# Altium schematic sheet Sheet1.SchDoc
size 420 x 297 mm; SheetNumber: 1; SheetTotal: 2
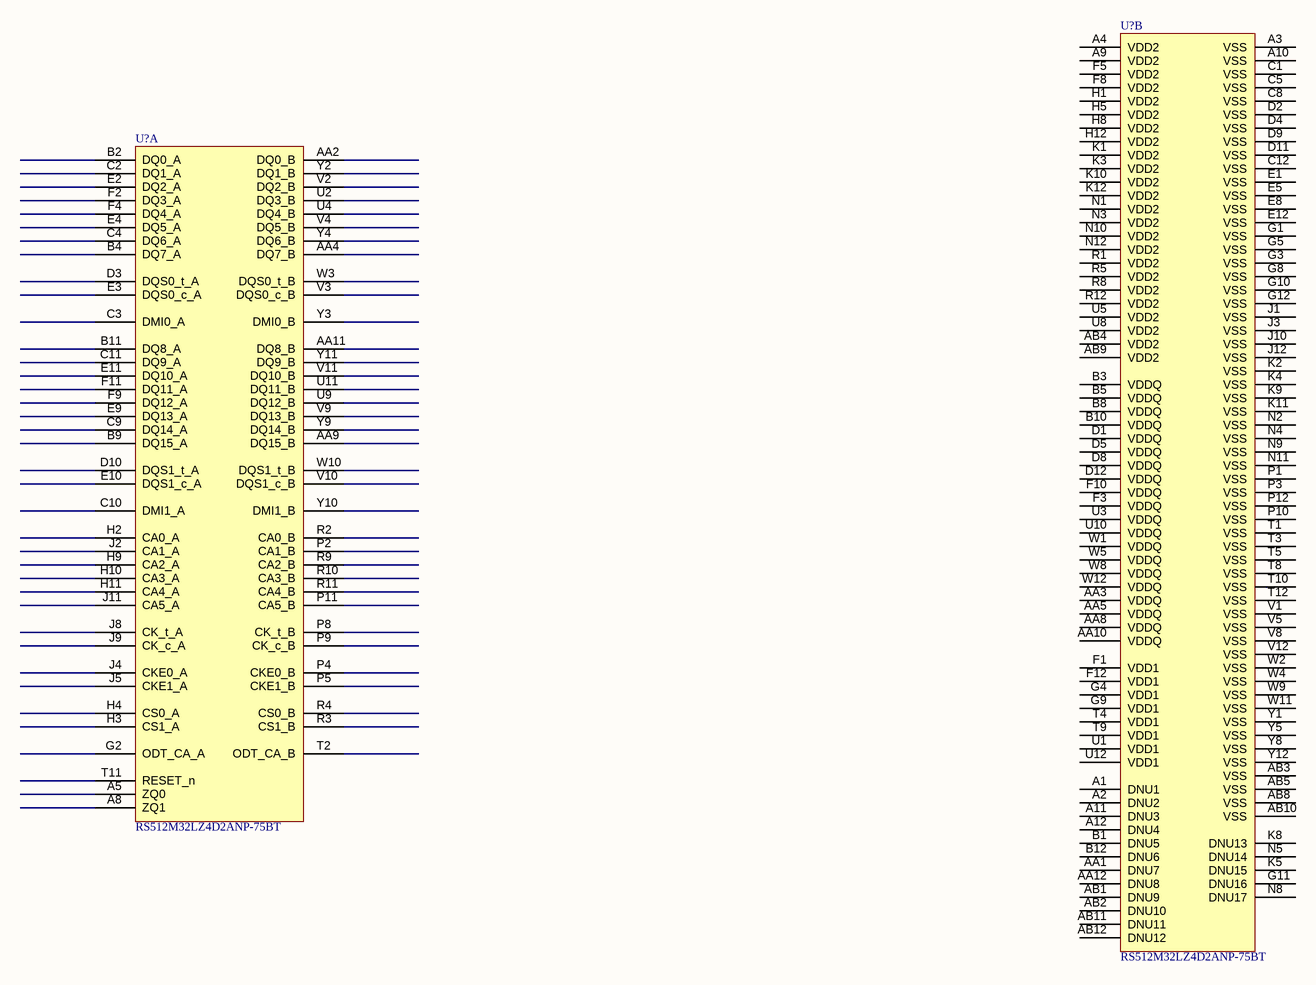
[diagram p0: Sheet1.SchDoc]

## Parts
(Parts that share a designator on the sheet are numbered #1, #2 ... from top to bottom, then left to right.)
U?#1  RS512M32LZ4D2ANP-75BT  [FBGA200_SMD]  (part B of 2)
U?#2  RS512M32LZ4D2ANP-75BT  [FBGA200_SMD]  (part A of 2)

## Nets

Not connected (* = marked no-connect by the designer): U?#1 A1(DNU1) A2(DNU2) A3(VSS) A4(VDD2) A9(VDD2) A10(VSS) A11(DNU3) A12(DNU4) AA1(DNU7) AA3(VDDQ) AA5(VDDQ) AA8(VDDQ) AA10(VDDQ) AA12(DNU8) AB1(DNU9) AB2(DNU10) AB3(VSS) AB4(VDD2) AB5(VSS) AB8(VSS) AB9(VDD2) AB10(VSS) AB11(DNU11) AB12(DNU12) B1(DNU5) B3(VDDQ) B5(VDDQ) B8(VDDQ) B10(VDDQ) B12(DNU6) C1(VSS) C5(VSS) C8(VSS) C12(VSS) D1(VDDQ) D2(VSS) D4(VSS) D5(VDDQ) D8(VDDQ) D9(VSS) D11(VSS) D12(VDDQ) E1(VSS) E5(VSS) E8(VSS) E12(VSS) F1(VDD1) F3(VDDQ) F5(VDD2) F8(VDD2) F10(VDDQ) F12(VDD1) G1(VSS) G3(VSS) G4(VDD1) G5(VSS) G8(VSS) G9(VDD1) G10(VSS) G11(DNU16) G12(VSS) H1(VDD2) H5(VDD2) H8(VDD2) H12(VDD2) J1(VSS) J3(VSS) J10(VSS) J12(VSS) K1(VDD2) K2(VSS) K3(VDD2) K4(VSS) K5(DNU15) K8(DNU13) K9(VSS) K10(VDD2) K11(VSS) K12(VDD2) N1(VDD2) N2(VSS) N3(VDD2) N4(VSS) N5(DNU14) N8(DNU17) N9(VSS) N10(VDD2) N11(VSS) N12(VDD2) P1(VSS) P3(VSS) P10(VSS) P12(VSS) R1(VDD2) R5(VDD2) R8(VDD2) R12(VDD2) T1(VSS) T3(VSS) T4(VDD1) T5(VSS) T8(VSS) T9(VDD1) T10(VSS) T12(VSS) U1(VDD1) U3(VDDQ) U5(VDD2) U8(VDD2) U10(VDDQ) U12(VDD1) V1(VSS) V5(VSS) V8(VSS) V12(VSS) W1(VDDQ) W2(VSS) W4(VSS) W5(VDDQ) W8(VDDQ) W9(VSS) W11(VSS) W12(VDDQ) Y1(VSS) Y5(VSS) Y8(VSS) Y12(VSS); U?#2 A5(ZQ0) A8(ZQ1) AA2(DQ0_B) AA4(DQ7_B) AA9(DQ15_B) AA11(DQ8_B) B2(DQ0_A) B4(DQ7_A) B9(DQ15_A) B11(DQ8_A) C2(DQ1_A) C3(DMI0_A) C4(DQ6_A) C9(DQ14_A) C10(DMI1_A) C11(DQ9_A) D3(DQS0_t_A) D10(DQS1_t_A) E2(DQ2_A) E3(DQS0_c_A) E4(DQ5_A) E9(DQ13_A) E10(DQS1_c_A) E11(DQ10_A) F2(DQ3_A) F4(DQ4_A) F9(DQ12_A) F11(DQ11_A) G2(ODT_CA_A) H2(CA0_A) H3(CS1_A) H4(CS0_A) H9(CA2_A) H10(CA3_A) H11(CA4_A) J2(CA1_A) J4(CKE0_A) J5(CKE1_A) J8(CK_t_A) J9(CK_c_A) J11(CA5_A) P2(CA1_B) P4(CKE0_B) P5(CKE1_B) P8(CK_t_B) P9(CK_c_B) P11(CA5_B) R2(CA0_B) R3(CS1_B) R4(CS0_B) R9(CA2_B) R10(CA3_B) R11(CA4_B) T2(ODT_CA_B) T11(RESET_n) U2(DQ3_B) U4(DQ4_B) U9(DQ12_B) U11(DQ11_B) V2(DQ2_B) V3(DQS0_c_B) V4(DQ5_B) V9(DQ13_B) V10(DQS1_c_B) V11(DQ10_B) W3(DQS0_t_B) W10(DQS1_t_B) Y2(DQ1_B) Y3(DMI0_B) Y4(DQ6_B) Y9(DQ14_B) Y10(DMI1_B) Y11(DQ9_B)

## Notes on the sheet
- THIS DOCUMENT AND THE DATA DISCLOSED HEREIN OR
- HEREWITH IS THE PROPERTY OF ALTIUM LIMITED AND MAY
- DWG NO:
- REVISION
- REV:
- DESCRIPTION
- DATE
- APPROVED
- BE FREELY DISTRIBUTED IN WHOLE. NO RIGHTS ARE
- RESERVED OR EXPRESS OR IMPLIED WARANTEE GIVEN.
- ENG:
- APPROVALS
- PROJECT
- DSN:
- CHK:
- REFERENCE DOCUMENTS
- PROJECT REVISION:
- TITLE
- DOCUMENT REVISION:
- DESIGN ITEM:
- BOM:
- FAB DWG:
- PCB DWG:
- ASSY DWG:
- SCALE:
- A3
- SIZE
- CAGE CODE
- FILE NAME
- DWG NO.
- SHEET
- OF
- REV

## Library data of the parts
U?#1 U?#2 = IC_RS512M32LZ4D2ANP-75BT: LPDDR4/4X Package FBGA 200b Density 4Gbit~64Gbit Operating Temperature Range：-25~85℃ Speed：2667Mbps/3200Mbps/3733Mbps Voltage：VDD1/VDD2/VDDQ= 1.8 / 1.1 / 1.1 V（LPDDR4）VDD1/VDD2/VDDQ = 1.8 / 1.1 / 0.6 V（LPDDR4X）Approved Verification Platform：MTK、Spreadtrum; Manufacturer: RAYSON; Manufacturer Part Number: RS512M32LZ4D2ANP-75BT; Case/Package: FBGA 200b; Supplier-1: RAYSON